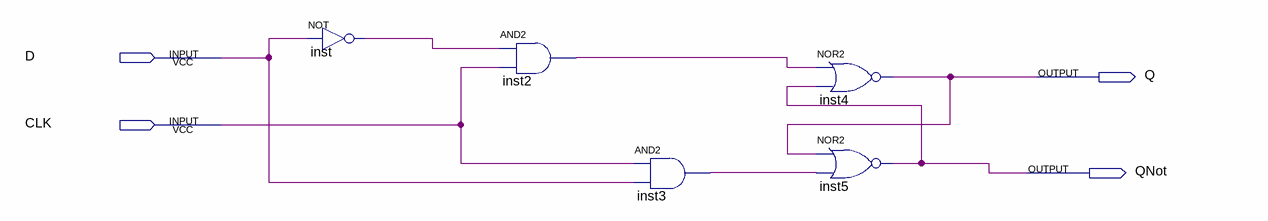
[diagram p0: schematic sheet]
// Quartus schematic NDFF.bdf as structural Verilog: 5 symbols, 4 pins
module NDFF (
  input  D,
  input  CLK,
  output Q,
  output QNot
);

  wire inst2_out, inst3_out, inst_out;

  not inst (inst_out, D);
  and inst2 (inst2_out, inst_out, CLK);
  and inst3 (inst3_out, CLK, D);
  nor inst4 (Q, inst2_out, QNot);
  nor inst5 (QNot, Q, inst3_out);
endmodule
